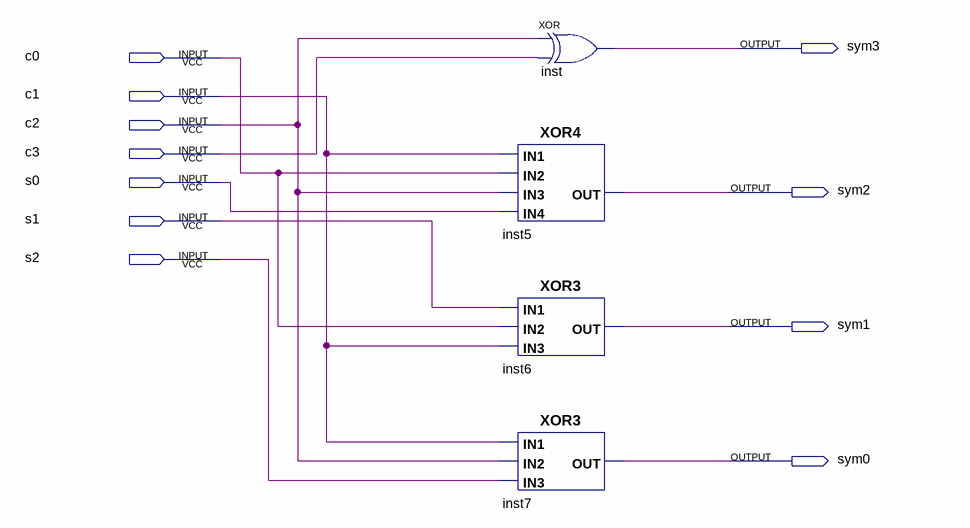
[diagram p0: schematic sheet]
// Quartus schematic syndrome.bdf as structural Verilog: 4 symbols, 11 pins
module syndrome (
  input  c0,
  input  c1,
  input  c2,
  input  c3,
  input  s0,
  input  s1,
  input  s2,
  output sym3,
  output sym2,
  output sym1,
  output sym0
);

  XOR4 inst5 (.IN3(c2), .IN4(s0), .IN2(c0), .IN1(c1), .OUT(sym2));
  XOR3 inst6 (.IN3(c1), .IN1(s1), .IN2(c0), .OUT(sym1));
  XOR3 inst7 (.IN3(s2), .IN1(c1), .IN2(c2), .OUT(sym0));
  xor inst (sym3, c2, c3);
endmodule
